# Altium schematic sheet Capteur.SchDoc
size A4; SheetNumber: 3; SheetTotal: 5
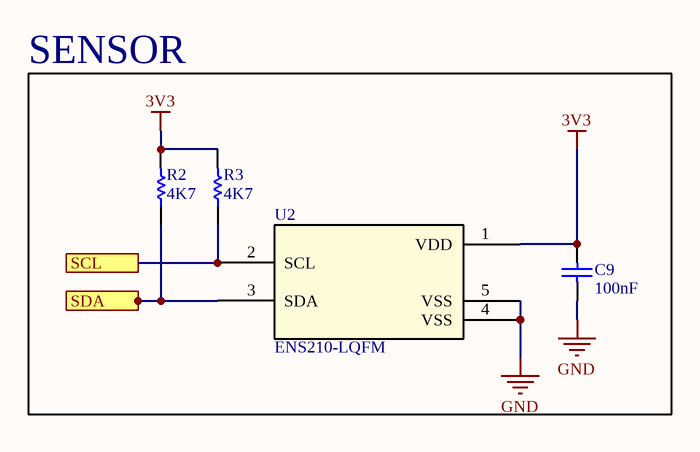
[diagram p0: Capteur.SchDoc]

## Parts
C9  100nF  [CAP_0402L]
R2  4K7  [RES_0402N]
R3  4K7  [RES_0402N]
U2  ENS210-LQFM  [SON-04-ENS210_2X2_AMS]

## Blocks framed on the sheet
SENSOR: C9 R2 R3 U2

## Ports
SCL, SDA

## Nets
3V3: C9.2 R2.2 R3.2 U2.1(VDD)
GND: C9.1 U2.4(VSS) U2.5(VSS)
SCL: R3.1 U2.2(SCL) ; port SCL
SDA: R2.1 U2.3(SDA) ; port SDA

## Library data of the parts
C9 = CAP CER 100nF: CAP CER 100nF 16V X7R 10% 0402; Capacitor Type: Ceramic; Mount: Surface Mount; RoHS: Yes; Tolerance: 10%; Value: 100nF; Case/Package: 0402; Construction: Flat; Width: 0.02inch; Voltage Rating: 16V; Packaging: Tape and Reel; Series: C; Thickness: 0.022inch; Voltage Rating (DC): 16V; Capacitance: 100nF; Dielectric Material: Ceramic; Package Quantity: 50000; Height: 0.5mm; Dielectric: X7R; Depth: 0.5mm; Length: 1mm; Max Operating Temperature: 125°C; Min Operating Temperature: -55°C
R2 R3 = Res_4K7: RES SMD 4.7K OHM 1% 1/16W 0402; Value: 0; Working Voltage: 50V; Temperature Coefficient: 100ppm/°C; Power Rating: 62.5mW; Resistance: 10kR; Lead Free: Lead Free; Height: 0.32mm; RoHS: Yes; Military Standard: Not; Lead Pitch: 0.2mm; Number of Terminations: 2; Case Code (Metric): 1005; REACH SVHC: No SVHC; Composition: Thick Film; Max Operating Temperature: 155°C; Tolerance: 1%; Min Operating Temperature: -55°C; Termination: SMD/SMT; Depth: 0.5mm; Width: 0.5mm; Voltage Rating: 50V; Number of Pins: 2; Length: 1mm; Case Code (Imperial): 0402; Case/Package: 0402; Mount: SMD; Packaging: Tape and Reel; Voltage Rating (DC): 50V
U2 = ENS210-LQFM: Description; Manufacturer_Name: ams OSRAM; Copyright: Copyright (C) 2025 Ultra Librarian. All rights reserved.; Manufacturer_Part_Number: ENS210-LQFM; RefDes: RefDes; Type: Type